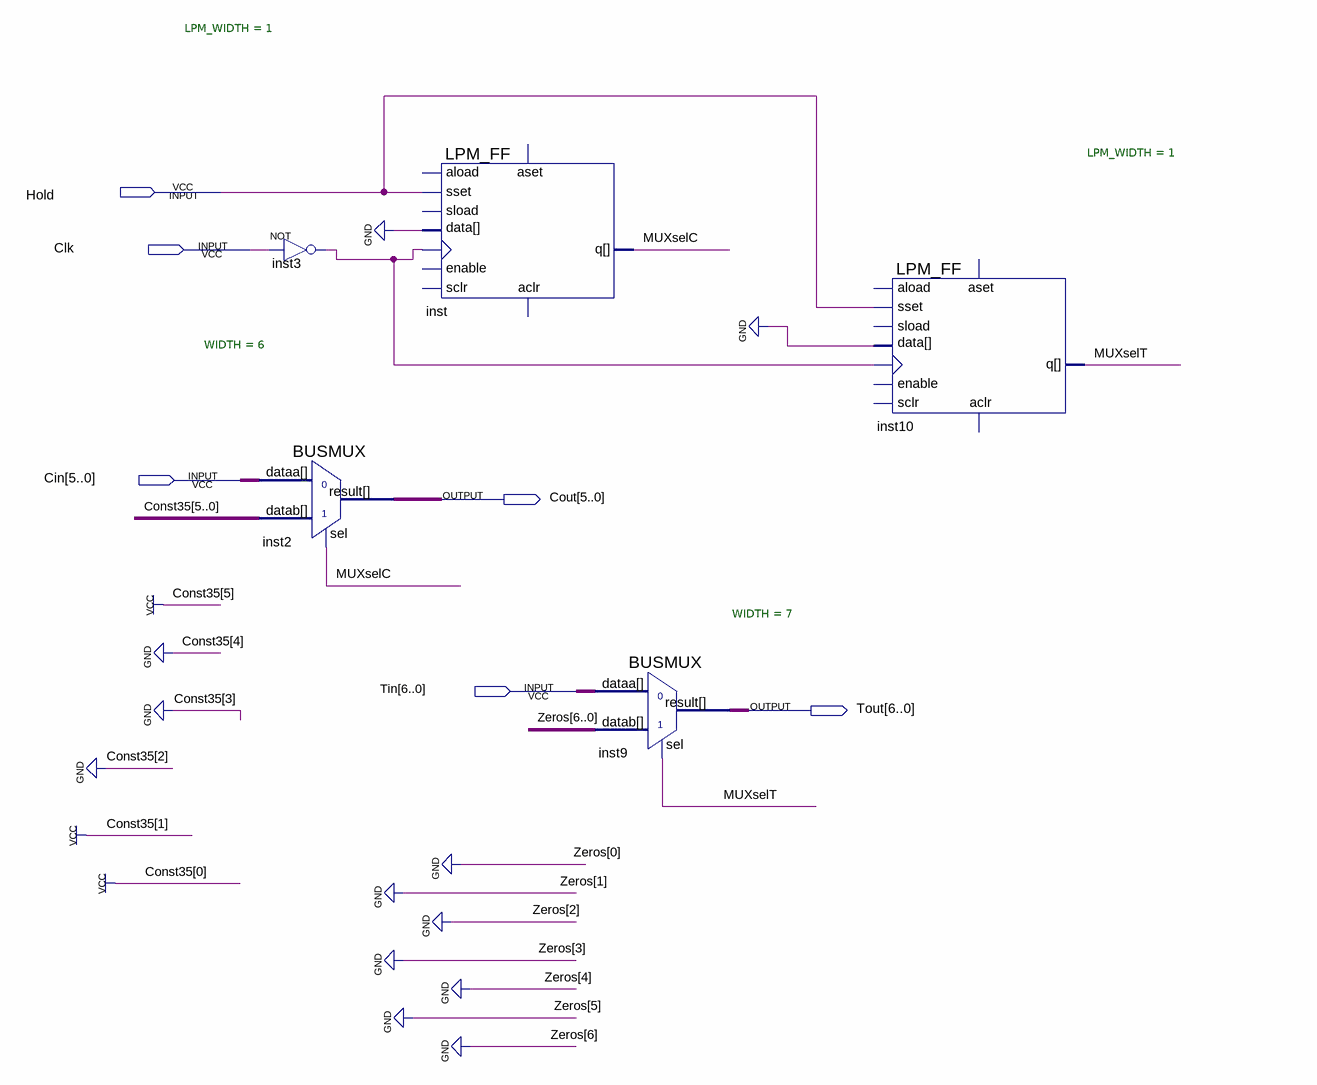
[diagram p0: schematic sheet]
// Quartus schematic UC1.bdf as structural Verilog: 5 symbols, 6 pins
module UC1 (
  input  Hold,
  input  Clk,
  input  [5:0] Cin,
  input  [6:0] Tin,
  output [5:0] Cout,
  output [6:0] Tout
);

  wire inst3_out, MUXselC, MUXselT;

  not inst3 (inst3_out, Clk);
  BUSMUX #(.WIDTH(6)) inst2 (.datab(6'b100011), .sel(MUXselC), .dataa(Cin), .result(Cout));
  LPM_FF #(.LPM_WIDTH(1)) inst (
    .clock(inst3_out), .sset(Hold), .data(1'b0), .q(MUXselC));  // open: enable, aload, sload, aset, sclr, aclr
  BUSMUX #(.WIDTH(7)) inst9 (.datab({7{1'b0}}), .sel(MUXselT), .dataa(Tin), .result(Tout));
  LPM_FF #(.LPM_WIDTH(1)) inst10 (
    .clock(inst3_out), .sset(Hold), .data(1'b0), .q(MUXselT));  // open: enable, aload, sload, aset, sclr, aclr
endmodule
